# EAGLE design GPS-L86-M33-V0.2 (EAGLE 9.6.2)
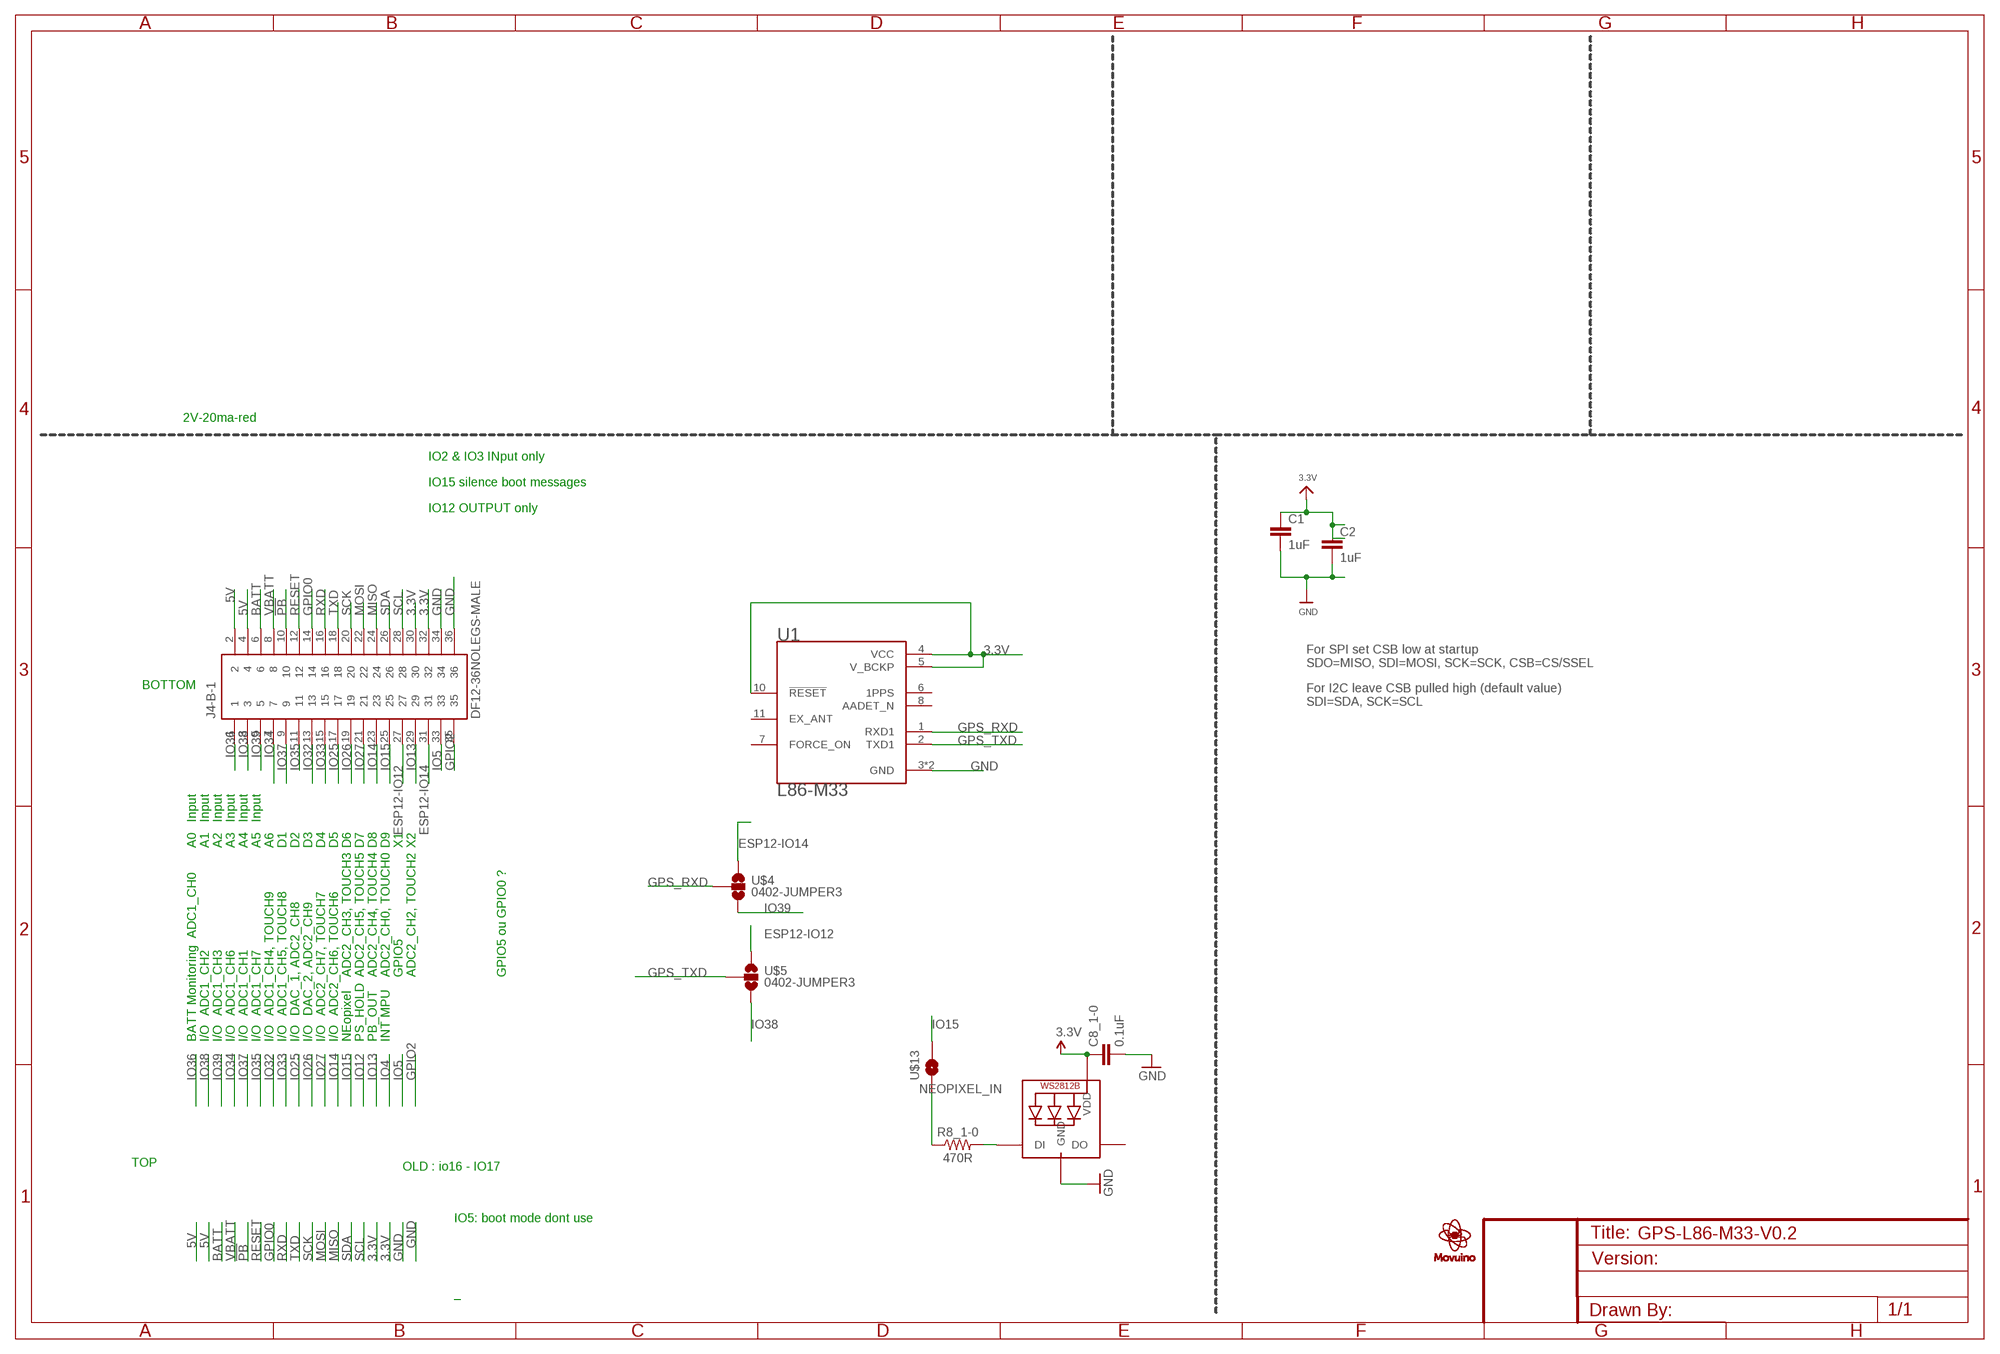
[diagram p0: schematic, sheet 1]

## Parts
C1  1uF  CAP0402-1UF  [0402-CAP]
C2  1uF  CAP0402-1UF  [0402-CAP]
C8_1-0  0.1uF  CAP0402-0.1UF  [0402-CAP]
J4-B-1  DF12-36NOLEGS-MALE  [DF12-36-DP-NL]
LED1-0  WS2812B3535  [LED3535]
R8_1-0  470R  RESISTORR0402-SMALL-TDOCU  [R0402-SMALL-TDOCU]
U1  L86-M33  [XCVR_L86-M33]
U$1  LOGO_MOVUINOTOP  [LOGO_MOVUINO_BMP_10MM]
U$4  0402-JUMPER3  [SJ_3]
U$5  0402-JUMPER3  [SJ_3]
U$13  0402-JUMPERCLOSED-DEFAULT  [0402-JUMPER-CLOSED]

## Nets
3.3V [pcbway_5mil]: C1.1 C2.1 C8_1-0.1 J4-B-1.30 J4-B-1.32 LED1-0.2(VDD) U1.4(VCC) U1.5(V_BCKP) U1.10(!RESET)
5V [pcbway_5mil]: J4-B-1.2 J4-B-1.4
!PB! [pcbway_5mil]: J4-B-1.10
BATT [pcbway_5mil]: J4-B-1.6
ESP12-IO12 [pcbway_5mil]: J4-B-1.27 U$5.1
ESP12-IO14 [pcbway_5mil]: J4-B-1.31 U$4.1
GND [pcbway_5mil]: C1.2 C2.2 C8_1-0.2 J4-B-1.34 J4-B-1.36 LED1-0.4(GND) U1.3(GND) U1.12(GND)
GPIO0 [pcbway_5mil]: J4-B-1.14
GPIO2 [pcbway_5mil]: J4-B-1.35
GPS_RXD: U1.1(RXD1) U$4.2
GPS_TXD: U1.2(TXD1) U$5.2
IO5 [pcbway_5mil]: J4-B-1.33
IO13 [pcbway_5mil]: J4-B-1.29
IO14 [pcbway_5mil]: J4-B-1.23
IO15 [pcbway_5mil]: J4-B-1.25 U$13.2
IO25 [pcbway_5mil]: J4-B-1.17
IO26 [pcbway_5mil]: J4-B-1.19
IO27 [pcbway_5mil]: J4-B-1.21
IO32 [pcbway_5mil]: J4-B-1.13
IO33 [pcbway_5mil]: J4-B-1.15
IO34 [pcbway_5mil]: J4-B-1.7
IO35 [pcbway_5mil]: J4-B-1.11
IO36 [pcbway_5mil]: J4-B-1.1
IO37 [pcbway_5mil]: J4-B-1.9
IO38 [pcbway_5mil]: J4-B-1.3 U$5.3
IO39 [pcbway_5mil]: J4-B-1.5 U$4.3
MISO [pcbway_5mil]: J4-B-1.24
MOSI [pcbway_5mil]: J4-B-1.22
N$18 [pcbway_smallest]: LED1-0.1(DI) R8_1-0.2
NEOPIXEL_IN [pcbway_smallest]: R8_1-0.1 U$13.1
RESET [pcbway_5mil]: J4-B-1.12
RXD [pcbway_5mil]: J4-B-1.16
SCK [pcbway_5mil]: J4-B-1.20
SCL [pcbway_5mil]: J4-B-1.28
SDA [pcbway_5mil]: J4-B-1.26
TXD [pcbway_5mil]: J4-B-1.18
VBATT [pcbway_5mil]: J4-B-1.8
Unconnected: LED1-0.3(DO) U1.6(1PPS) U1.7(FORCE_ON) U1.8(AADET_N) U1.11(EX_ANT)

## Notes on the sheet
- 2V-20ma-red
- IO2 & IO3 INput only
- IO15 silence boot messages
- IO12 OUTPUT only
- For SPI set CSB low at startup
  SDO=MISO, SDI=MOSI, SCK=SCK, CSB=CS/SSEL
- BOTTOM
- For I2C leave CSB pulled high (default value)
  SDI=SDA, SCK=SCL
- Input | Input | Input | Input | Input | Input
- A0 | A1 | A2 | A3 | A4 | A5 | A6 | D1 | D2 | D3 | D4 | D5 | D6 | D7 | D8 | D9 | X1 | X2
- ADC1_CH0
- ADC2_CH3, TOUCH3 | ADC2_CH5, TOUCH5 | ADC2_CH4, TOUCH4 | ADC2_CH0, TOUCH0 | GPIO5 | ADC2_CH2, TOUCH2 | GPIO5 ou GPIO0 ?
- ADC1_CH2 | ADC1_CH3 | ADC1_CH6 | ADC1_CH1 | ADC1_CH7 | ADC1_CH4, TOUCH9 | ADC1_CH5, TOUCH8 | DAC_1, ADC2_CH8 | DAC_2, ADC2_CH9 | ADC2_CH7, TOUCH7 | ADC2_CH6, TOUCH6
- BATT Monitoring | I/O | I/O | I/O | I/O | I/O | I/O | I/O | I/O | I/O | I/O | I/O | NEopixel | PS_HOLD | PB_OUT | INT MPU
- TOP
- OLD : io16 - IO17
- IO5: boot mode dont use

## Library data of the parts
C1 C2 = movuino:CAP: Capacitor Standard 0402 ceramic capacitor 0.1uF , 100nF; DIELECTRIC: MLCC, X5R; MF: Murata Electronics; MPN: GRM155R61A105KE15D; OC_MOUSER: 81-GRM155R61A105KE15; OC_RS: 7235199; TOLERANCE: 10%; VOLTAGE: 10V
C8_1-0 = movuino:CAP: Capacitor Standard 0402 ceramic capacitor 0.1uF , 100nF; DIELECTRIC: MLCC, X5R; MF: Murata Electronics; MPN: GRM155R61C104KA88D; OC_MOUSER: 81-GRM155R61C104KA8D; OC_RS: 7235200; TOLERANCE: 10%; VOLTAGE: 16V
J4-B-1 = movuino:DF12-36: CONN HEADER 32POS 3MM SMD 0.5MM
LED1-0 = adafruit:WS2812B
R8_1-0 = movuinoV0:RESISTOR: Resistor Basic schematic elements and footprints for 0402 , 0603, 1206, and PTH resistors.
U1 = movuino:L86-M33: L86 is an ultra-compact GNSS POT (Patch on Top) module with an embedded 18.4mm × 18.4mm × 4.0mm patch antenna and utilizes the MediaTek new generation GNSS chipset MT3333 that achieves the perfect performance Check prices <https://pricing.snapeda.com/parts/L86-M33/Quectel/view-part?ref=eda>; AVAILABILITY: Warning; DESCRIPTION: L86 is an ultra-compact GNSS POT (Patch on Top) module with an embedded 18.4mm × 18.4mm × 4.0mm patch antenna and utilizes the MediaTek new generation GNSS chipset MT3333 that achieves the perfect performance; MF: Quectel; MP: L86-M33; PACKAGE: LCC-12 Quectel; PRICE: None; PURCHASE-URL: https://pricing.snapeda.com/search/part/L86-M33/?ref=eda
U$1 = movuino:LOGO_MOVUINO
U$4 U$5 = movuino:0402-JUMPER3
U$13 = movuino:0402-JUMPER

## Net classes
1 pcbway_smallest: width 0.102 mm, drill 0.2 mm, clearance 0.102 mm
2 pcbway_cheap: width 0.152 mm, drill 0.3 mm, clearance 0.152 mm
3 pcbway_5mil: width 0.127 mm, drill 0.25 mm, clearance 0.127 mm

## Board
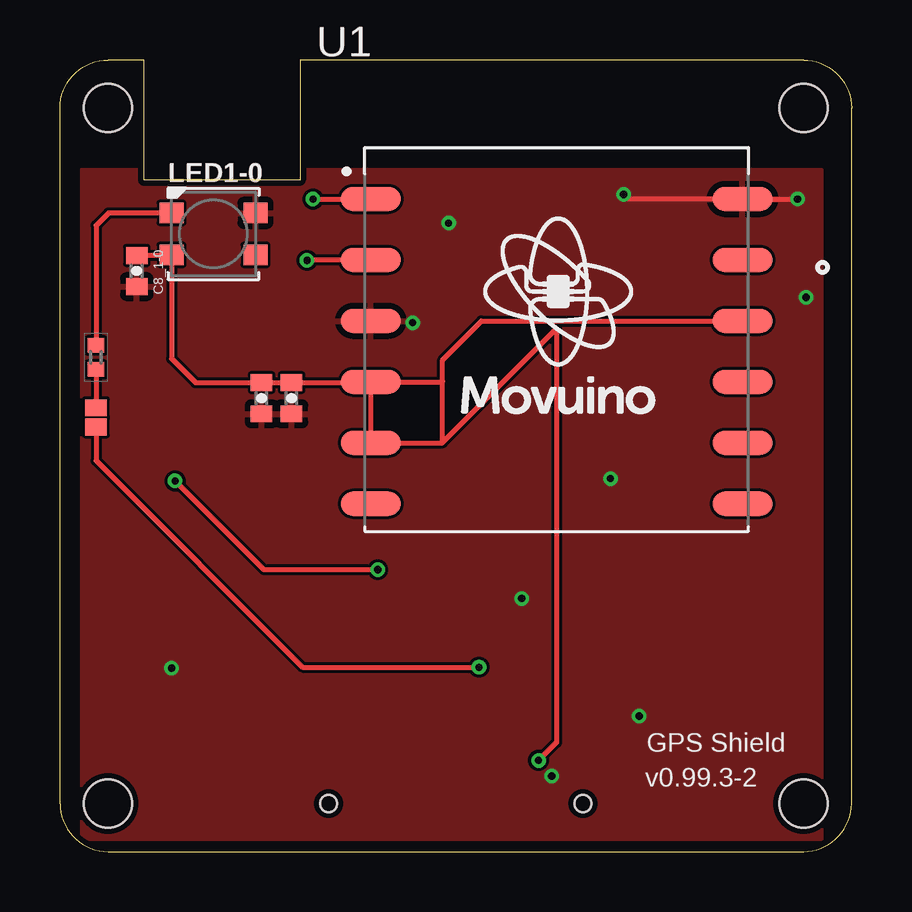
[diagram p1: board, top side]
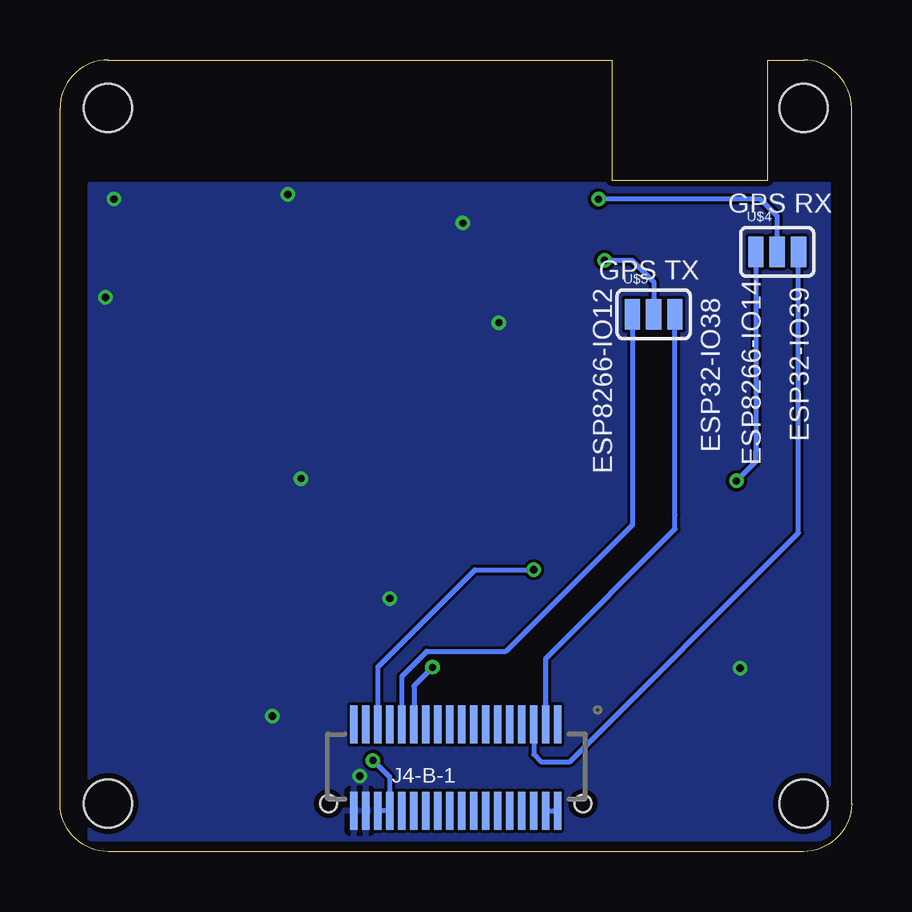
[diagram p2: board, bottom side, seen from below]

Size 33 x 33 mm. Coordinates in mm from the lower left corner, seen from the top.
Outline: 0,2 0,31 arc-90 2,33 3.5,33 3.5,28 10,28 10,33 31,33 arc-90 33,31 33,2 arc-90 31,0 2,0 arc-90 0,2
Copper layers (1*16): Top 0.035mm / dielectric 1.5mm / Bottom 0.035mm
Design rules "PCBWAY_2layer_DRU_no_angle_5mil": minimum track width 5mil, minimum drill 0.25mm, track to track 5mil, track to pad 5mil, pad to pad 5mil, via to via 5mil, smd to smd 0mil, copper to edge 10mil, drill to drill 10mil, minimum pad ring 10mil, minimum via ring 6mil, stop-mask expansion 2mil, vias tented up to drill 100mil, thermal gap 10mil
Holes 2 mm at 31,31 2,2 2,31 31,2

### Footprints (pad centres in the part's own frame; a part is rotated, then mirrored left to right if it is on the bottom)
0402-CAP = smd 0.7 x 0.9: 1 -0.65,0; 2 0.65,0
DF12-36-DP-NL = smd 0.3 x 1.6: 1 -4.25,-1.8; 2 -4.25,1.8; 3 -3.75,-1.8; 4 -3.75,1.8; 5 -3.25,-1.8; 6 -3.25,1.8; 7 -2.75,-1.8; 8 -2.75,1.8; 9 -2.25,-1.8; 10 -2.25,1.8; 11 -1.75,-1.8; 12 -1.75,1.8; 13 -1.25,-1.8; 14 -1.25,1.8; 15 -0.75,-1.8; 16 -0.75,1.8; 17 -0.25,-1.8; 18 -0.25,1.8; 19 0.25,-1.8; 20 0.25,1.8; 21 0.75,-1.8; 22 0.75,1.8; 23 1.25,-1.8; 24 1.25,1.8; 25 1.75,-1.8; 26 1.75,1.8; 27 2.25,-1.8; 28 2.25,1.8; 29 2.75,-1.8; 30 2.75,1.8; 31 3.25,-1.8; 32 3.25,1.8; 33 3.75,-1.8; 34 3.75,1.8; 35 4.25,-1.8; 36 4.25,1.8 | hole 0.7: -5.3,1.5; 5.3,1.5
LED3535 = smd 1 x 0.85: 1 -1.75,0.875; 2 -1.75,-0.875; 3 1.75,-0.875; 4 1.75,0.875
R0402-SMALL-TDOCU = smd 0.6 x 0.7: 1 -0.5,0; 2 0.5,0
XCVR_L86-M33 = smd 2.5 x 1: 1 -7.75,6.35; 2 -7.75,3.81; 3 -7.75,1.27; 4 -7.75,-1.27; 5 -7.75,-3.81; 6 -7.75,-6.35; 7 7.75,-6.35; 8 7.75,-3.81; 9 7.75,-1.27; 10 7.75,1.27; 11 7.75,3.81; 12 7.75,6.35
SJ_3 = smd 0.635 x 1.27: 1 -0.889,0; 2 0,0; 3 0.889,0
0402-JUMPER-CLOSED = smd 0.7 x 0.9: 1 -0.4,0; 2 0.4,0

### Placement (x,y rotation side)
C1  9.65,18.9 270 top
C2  8.4,18.9 270 top
C8_1-0  3.2,24.2 270 top
J4-B-1  16.5,3.5 180 bottom
LED1-0  6.4,25.75 0 top
R8_1-0  1.5,20.6 90 top
U1  20.7,20.85 0 top
U$1  20.7,23.35 0 top
U$4  3.1,25 0 bottom
U$5  8.25,22.4 0 bottom
U$13  1.5,18.1 270 top

### Tracks (layer width: path | path; a pad name or v marks a point on that pad's centre or on a via)
3.3V  (via drill 0.3 pad 0.6)
  Top 0.2: U1.10 17.57,22.12 15.95,20.5 15.95,19.6 | v19.95,3.8 20.7,4.55 20.7,21.8 15.95,17.05 | 15.95,17.05 15.95,19.6 | 12.95,19.45 U1.4 15.93,19.58 15.95,19.6 | 12.95,19.45 U1.5 15.94,17.04 15.95,17.05 | 12.95,19.45 12.85,19.55 C1.1 C2.1
  Top 0.203: C8_1-0.1 3.23,24.88 LED1-0.2 4.65,20.55 5.65,19.55 C2.1
  Bottom 0.2: J4-B-1.32 J4-B-1.30 19.25,3.1 v19.95,3.8
5V
  Bottom 0.2: J4-B-1.4 J4-B-1.2
ESP12-IO12
  Bottom 0.203: U$5.1 9.14,13.61 14.4,8.35 17.7,8.35 18.75,7.3 J4-B-1.27
ESP12-IO14  (via drill 0.3 pad 0.6)
  Top 0.203: v13.25,11.75 8.5,11.75 v4.8,15.45
  Bottom 0.203: U$4.1 3.99,16.7 3.99,16.26 v4.8,15.45 | J4-B-1.31 19.75,7.7 15.7,11.75 v13.25,11.75
GND  (via drill 0.3 pad 0.6)
  Top 0.2: v30.75,27.2 U1.12 23.7,27.2 v23.5,27.4
  other vias: 20.5,3.15 24.15,5.65 14.7,22.05 16.2,26.2 4.65,7.65 22.95,15.55 31.1,23.1 19.25,10.55
  pour Top: 31.75,28.45 31.75,0.5 0.9,0.5 0.9,28.45
  pour Bottom: 31.8,27.85 31.8,0.5 0.9,0.5 0.9,27.85
GPS_RXD  (via drill 0.3 pad 0.6)
  Top 0.203: v10.55,27.2 U1.1
  Bottom 0.203: U$4.2 3.1,26.5 3.8,27.2 v10.55,27.2
GPS_TXD  (via drill 0.3 pad 0.6)
  Top 0.203: U1.2 v10.31,24.66 v10.3,24.65
  Bottom 0.203: v10.3,24.65 9.15,24.65 8.25,23.75 U$5.2
IO15  (via drill 0.3 pad 0.6)
  Top 0.203: U$13.2 1.5,16.3 10.12,7.68 v17.47,7.68
  Bottom 0.203: v17.47,7.68 18.25,6.9 J4-B-1.25
IO38
  Bottom 0.2: J4-B-1.3 12.75,6.35
  Bottom 0.203: U$5.3 7.36,14.05 7.36,13.44 12.75,8.05 12.75,6.35
IO39
  Bottom 0.203: J4-B-1.5 13.25,4.05 12.95,3.75 11.75,3.75 2.21,13.29 U$4.3
N$18
  Top 0.203: LED1-0.1 2.02,26.62 1.5,26.1 R8_1-0.2
NEOPIXEL_IN
  Top 0.203: R8_1-0.1 U$13.1

### Text on the board
tPlace: GPS Shield | v0.99.3-2
bPlace: GPS RX | ESP32-IO39 | ESP8266-IO14 | GPS TX | ESP8266-IO12 | ESP32-IO38